# EAGLE design Schm1 (EAGLE 6.6.0)
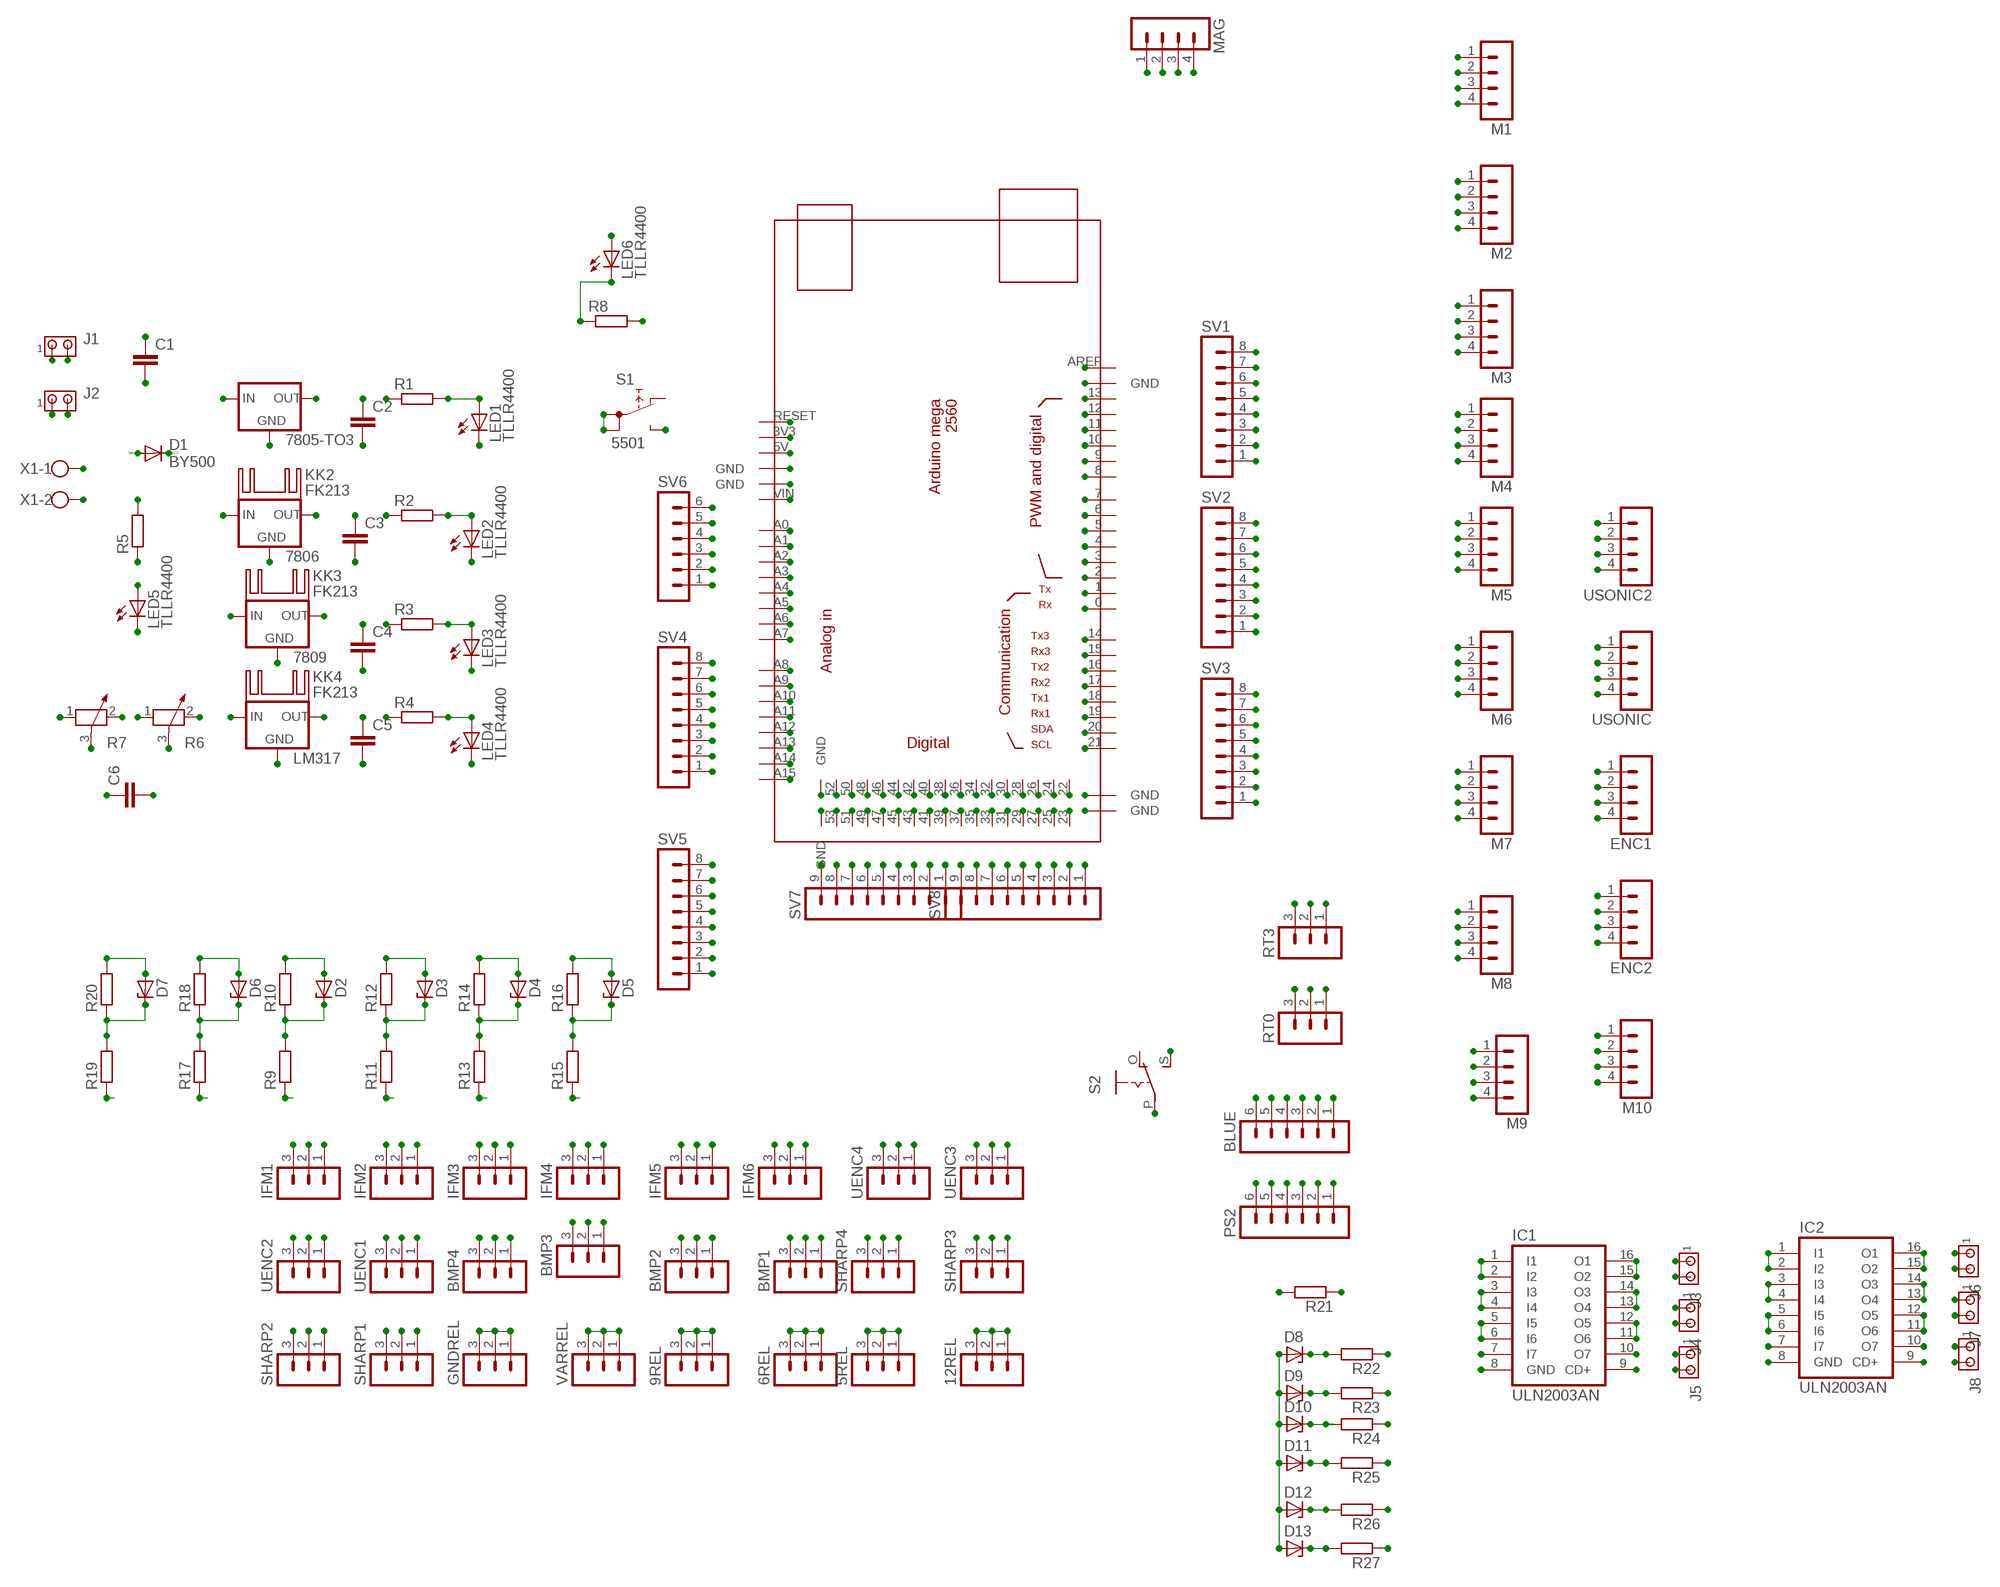
[diagram p0: schematic, sheet 1]

## Parts
5REL  MA03-1  [MA03-1]
6REL  MA03-1  [MA03-1]
9REL  MA03-1  [MA03-1]
12REL  MA03-1  [MA03-1]
7805-TO3  78XX-TO3  [TO3-78]
7806  78XXS  [78XXS]
7809  78XXS  [78XXS]
BLUE  MA06-1  [MA06-1]
BMP1  MA03-1  [MA03-1]
BMP2  MA03-1  [MA03-1]
BMP3  MA03-1  [MA03-1]
BMP4  MA03-1  [MA03-1]
C1  C-EU075-063X106  [C075-063X106]
C2  C-EU050-075X075  [C050-075X075]
C3  C-EU050-075X075  [C050-075X075]
C4  C-EU050-075X075  [C050-075X075]
C5  C-EU050-075X075  [C050-075X075]
C6  C-EU050-075X075  [C050-075X075]
D1  BY500  [DO201-15]
D2  ZENER-DIODEDO34-7  [DO34Z7]
D3  ZENER-DIODEDO34-7  [DO34Z7]
D4  ZENER-DIODEDO34-7  [DO34Z7]
D5  ZENER-DIODEDO34-7  [DO34Z7]
D6  ZENER-DIODEDO34-7  [DO34Z7]
D7  ZENER-DIODEDO34-7  [DO34Z7]
D8  ZENER-DIODEDO34-7  [DO34Z7]
D9  ZENER-DIODEDO34-7  [DO34Z7]
D10  ZENER-DIODEDO34-7  [DO34Z7]
D11  ZENER-DIODEDO34-7  [DO34Z7]
D12  ZENER-DIODEDO34-7  [DO34Z7]
D13  ZENER-DIODEDO34-7  [DO34Z7]
ENC1  MA04-1  [MA04-1]
ENC2  MA04-1  [MA04-1]
GNDREL  MA03-1  [MA03-1]
IC1  ULN2003AN  [DIL16]
IC2  ULN2003AN  [DIL16]
IFM1  MA03-1  [MA03-1]
IFM2  MA03-1  [MA03-1]
IFM3  MA03-1  [MA03-1]
IFM4  MA03-1  [MA03-1]
IFM5  MA03-1  [MA03-1]
IFM6  MA03-1  [MA03-1]
J1  MTA02-156  [1X2MTA]
J2  MTA02-156  [1X2MTA]
J3  MTA02-100  [10X02MTA]
J4  MTA02-100  [10X02MTA]
J5  MTA02-100  [10X02MTA]
J6  MTA02-100  [10X02MTA]
J7  MTA02-100  [10X02MTA]
J8  MTA02-100  [10X02MTA]
KK2  FK213  [FK213]
KK3  FK213  [FK213]
KK4  FK213  [FK213]
LED1  TLLR4400  [LED3MM]
LED2  TLLR4400  [LED3MM]
LED3  TLLR4400  [LED3MM]
LED4  TLLR4400  [LED3MM]
LED5  TLLR4400  [LED3MM]
LED6  TLLR4400  [LED3MM]
LM317  78XXS  [78XXS]
M1  MA04-1  [MA04-1]
M2  MA04-1  [MA04-1]
M3  MA04-1  [MA04-1]
M4  MA04-1  [MA04-1]
M5  MA04-1  [MA04-1]
M6  MA04-1  [MA04-1]
M7  MA04-1  [MA04-1]
M8  MA04-1  [MA04-1]
M9  MA04-1  [MA04-1]
M10  MA04-1  [MA04-1]
MAG  MA04-1  [MA04-1]
PS2  MA06-1  [MA06-1]
R1  R-EU_0207/10  [0207/10]
R2  R-EU_0207/10  [0207/10]
R3  R-EU_0207/10  [0207/10]
R4  R-EU_0207/10  [0207/10]
R5  R-EU_0207/10  [0207/10]
R6  POTENTIOMETER_PT-10  [PT-10]
R7  POTENTIOMETER_PT-10  [PT-10]
R8  R-EU_0207/10  [0207/10]
R9  R-EU_0207/10  [0207/10]
R10  R-EU_0207/10  [0207/10]
R11  R-EU_0207/10  [0207/10]
R12  R-EU_0207/10  [0207/10]
R13  R-EU_0207/10  [0207/10]
R14  R-EU_0207/10  [0207/10]
R15  R-EU_0207/10  [0207/10]
R16  R-EU_0207/10  [0207/10]
R17  R-EU_0207/10  [0207/10]
R18  R-EU_0207/10  [0207/10]
R19  R-EU_0207/10  [0207/10]
R20  R-EU_0207/10  [0207/10]
R21  R-EU_0207/10  [0207/10]
R22  R-EU_0207/10  [0207/10]
R23  R-EU_0207/10  [0207/10]
R24  R-EU_0207/10  [0207/10]
R25  R-EU_0207/10  [0207/10]
R26  R-EU_0207/10  [0207/10]
R27  R-EU_0207/10  [0207/10]
RT0  MA03-1  [MA03-1]
RT3  MA03-1  [MA03-1]
S1  5501  [5501]
S2  EG1218S  [EG1218]
SHARP1  MA03-1  [MA03-1]
SHARP2  MA03-1  [MA03-1]
SHARP3  MA03-1  [MA03-1]
SHARP4  MA03-1  [MA03-1]
SV1  MA08-1  [MA08-1]
SV2  MA08-1  [MA08-1]
SV3  MA08-1  [MA08-1]
SV4  MA08-1  [MA08-1]
SV5  MA08-1  [MA08-1]
SV6  MA06-1  [MA06-1]
SV7  MA09-1  [MA09-1]
SV8  MA09-1  [MA09-1]
U$1  MEGA_DEVICE  [MEGABOX]
UENC1  MA03-1  [MA03-1]
UENC2  MA03-1  [MA03-1]
UENC3  MA03-1  [MA03-1]
UENC4  MA03-1  [MA03-1]
USONIC  MA04-1  [MA04-1]
USONIC2  MA04-1  [MA04-1]
VARREL  MA03-1  [MA03-1]
X1  W237-102  [W237-102]

## Nets
0: RT0.2 SV2.1 U$1.0
1: RT0.3 SV2.2 U$1.1
2: ENC1.1 SV2.3 U$1.2 UENC1.3
3: ENC1.2 SV2.4 U$1.3 UENC2.3
3V3: MAG.2 SV6.5 U$1.3V3
4: M1.1 SV2.5 U$1.4
5: M6.1 SV2.6 U$1.5
5OUT: 5REL.1 5REL.2 5REL.3 7805-TO3.1(OUT) BLUE.3 BMP1.2 BMP2.2 BMP3.2 BMP4.2 C2.1 ENC1.3 ENC2.3 PS2.2 R1.1 R21.1 SHARP1.1 SHARP2.1 SHARP3.1 SHARP4.1 UENC1.2 UENC2.2 UENC3.2 UENC4.2 USONIC2.4 USONIC.4
6: M7.1 SV2.7 U$1.6
6OUT: 6REL.1 6REL.2 6REL.3 7806.OUT C3.1 R2.1
7: M8.1 SV2.8 U$1.7
8: M9.1 SV1.1 U$1.8
9: M10.1 SV1.2 U$1.9
10: M5.1 SV1.3 U$1.10
11: M4.1 SV1.4 U$1.11
12: M3.1 SV1.5 U$1.12
12IN: 7805-TO3.2(IN) 7806.IN 7809.IN C6.1 D1.C LM317.IN
12V: 12REL.1 12REL.2 12REL.3 C1.1 D1.A IC1.9(CD+) IC2.9(CD+) IFM1.2 IFM2.2 IFM3.2 IFM4.2 IFM5.2 IFM6.2 J1.1 J2.1 J3.1 J4.1 J5.1 J6.1 J7.1 J8.1 R5.2 X1.1
13: M2.1 SV1.6 U$1.13
14: RT3.3 SV3.8 U$1.14
15: RT3.2 SV3.7 U$1.15
16: BLUE.5 SV3.6 U$1.16
17: BLUE.4 SV3.5 U$1.17
18: ENC2.1 SV3.4 U$1.18 UENC3.3
19: ENC2.2 SV3.3 U$1.19 UENC4.3
20: MAG.3 SV3.2 U$1.20
21: MAG.4 SV3.1 U$1.21
22: M1.2 U$1.22
23: M1.3 SV8.2 U$1.23
24: M2.2 U$1.24
25: M6.2 SV8.3 U$1.25
26: M2.3 U$1.26
27: M6.3 SV8.4 U$1.27
28: M3.2 U$1.28
29: M7.2 SV8.5 U$1.29
30: M3.3 U$1.30
31: M7.3 SV8.6 U$1.31
32: M4.2 U$1.32
33: M8.2 SV8.7 U$1.33
34: M4.3 U$1.34
35: M8.3 SV8.8 U$1.35
36: M5.2 U$1.36
37: M9.2 SV8.9 U$1.37
38: M5.3 U$1.38
39: M9.3 SV7.1 U$1.39
40: BMP4.3 U$1.40
41: D11.C R25.2 SV7.2 U$1.41
42: BMP2.3 U$1.42
43: D12.C R26.2 SV7.3 U$1.43
44: BMP1.3 U$1.44
45: D13.C R27.2 SV7.4 U$1.45
46: BMP3.3 U$1.46
47: PS2.6 SV7.5 U$1.47
48: D10.C R24.2 U$1.48
49: PS2.5 SV7.6 U$1.49
50: D9.C R23.2 U$1.50
51: PS2.4 SV7.7 U$1.51
52: D8.C R22.2 U$1.52
53: PS2.3 R21.2 SV7.8 U$1.53
A0: M10.3 SV4.8 U$1.A0
A1: M10.2 SV4.7 U$1.A1
A2: SHARP1.3 SV4.6 U$1.A2
A3: SHARP2.3 SV4.5 U$1.A3
A4: SHARP3.3 SV4.4 U$1.A4
A5: SHARP4.3 SV4.3 U$1.A5
A6: SV4.2 U$1.A6 USONIC.3
A7: SV4.1 U$1.A7 USONIC.2
A8: SV5.8 U$1.A8 USONIC2.3
A9: SV5.7 U$1.A9 USONIC2.2
A10: D7.C R19.2 R20.1 SV5.6 U$1.A10
A11: D6.C R17.2 R18.1 SV5.5 U$1.A11
A12: D2.C R9.2 R10.1 SV5.4 U$1.A12
A13: D3.C R11.2 R12.1 SV5.3 U$1.A13
A14: D4.C R13.2 R14.1 SV5.2 U$1.A14
A15: D5.C R15.2 R16.1 SV5.1 U$1.A15
AREF: SV1.8 U$1.AREF
B3V3: BLUE.2 S2.P
DIN: LED5.A R5.1
GND: 7805-TO3.3(GND) 7806.GND 7809.GND BLUE.1 BMP1.1 BMP2.1 BMP3.1 BMP4.1 C1.2 C2.2 C3.2 C4.2 C5.2 C6.2 D2.A D3.A D4.A D5.A D6.A D7.A D8.A D9.A D10.A D11.A D12.A D13.A ENC1.4 ENC2.4 GNDREL.1 GNDREL.2 GNDREL.3 IC1.8(GND) IC2.8(GND) IFM1.1 IFM2.1 IFM3.1 IFM4.1 IFM5.1 IFM6.1 J1.2 J2.2 LED1.K(C) LED2.K(C) LED3.K(C) LED4.K(C) LED5.K(C) M1.4 M2.4 M3.4 M4.4 M5.4 M6.4 M7.4 M8.4 M9.4 M10.4 MAG.1 PS2.1 R7.3 R8.2 R10.2 R12.2 R14.2 R16.2 R18.2 R20.2 RT0.1 RT3.1 S1.NO SHARP1.2 SHARP2.2 SHARP3.2 SHARP4.2 SV1.7 SV6.2 SV6.3 SV7.9 U$1.GND@1(GND) U$1.GND@2(GND) U$1.GND@3(GND) U$1.GND@6(GND) U$1.GND@7(GND) UENC1.1 UENC2.1 UENC3.1 UENC4.1 USONIC2.1 USONIC.1 X1.2
JOK1: LM317.GND R6.3 R7.1
KEY: BLUE.6 S2.S
N$3: R7.2
N$4: LED6.K(C) R8.1
N$7: R6.2
N$10: IC1.7(I7)
N$13: LED4.A R4.2
N$16: LED3.A R3.2
N$17: LED2.A R2.2
N$20: LED1.A R1.2
N$22: IC1.10(O7)
N$25: IC2.7(I7)
N$38: IC2.10(O7)
PN1: IC1.15(O2) IC1.16(O1) J3.2
PN2: IC1.13(O4) IC1.14(O3) J4.2
PN3: IC1.11(O6) IC1.12(O5) J5.2
PN4: IC2.15(O2) IC2.16(O1) J6.2
PN5: IC2.13(O4) IC2.14(O3) J7.2
PN6: IC2.11(O6) IC2.12(O5) J8.2
RESET: S1.1A S1.1B SV6.6 U$1.RESET
S1: IFM1.3 R19.1
S2: IFM2.3 R17.1
S3: IFM3.3 R9.1
S4: IFM4.3 R11.1
S5: IFM5.3 R13.1
S6: IFM6.3 R15.1
U1: IC1.5(I5) IC1.6(I6) R22.1
U2: IC1.3(I3) IC1.4(I4) R23.1
U3: IC1.1(I1) IC1.2(I2) R24.1
U4: IC2.5(I5) IC2.6(I6) R25.1
U5: IC2.3(I3) IC2.4(I4) R26.1
U6: IC2.1(I1) IC2.2(I2) R27.1
VAROUT: C5.1 LM317.OUT R4.1 R6.1 VARREL.1 VARREL.2 VARREL.3
VCC: LED6.A SV6.4 SV8.1 U$1.5V U$1.GND@4(GND) U$1.GND@5(GND)
VIN: 9REL.1 9REL.2 9REL.3 7809.OUT C4.1 R3.1 SV6.1 U$1.VIN
Unconnected: S1.NC S2.O

## Library data of the parts
5REL 6REL 9REL 12REL BMP1-BMP4 GNDREL IFM1-IFM6 RT0 RT3 SHARP1-SHARP4 UENC1-UENC4 VARREL = con-lstb:MA03-1: PIN HEADER; OC_FARNELL: unknown; OC_NEWARK: unknown
7805-TO3 = v-reg:78XX-TO3: VOLTAGE REGULATOR
7806 7809 LM317 = v-reg:78XXS: VOLTAGE REGULATOR
BLUE PS2 SV6 = con-lstb:MA06-1: PIN HEADER; OC_FARNELL: unknown; OC_NEWARK: unknown
C1-C6 = rcl:C-EU: CAPACITOR, European symbol
D1 = diode:BY500: DIODE fast recovery diode, 5 A, 800 V
D2-D13 = diode:ZENER-DIODE: Z-Diode
ENC1 ENC2 M1-M10 MAG USONIC USONIC2 = con-lstb:MA04-1: PIN HEADER; OC_FARNELL: unknown; OC_NEWARK: unknown
IC1 IC2 = uln-udn:ULN2003A: DRIVER ARRAY
J1 J2 = con-amp:MTA02-156: AMP connector
J3-J8 = con-amp:MTA02-100: AMP connector
KK2-KK4 = heatsink:FK213: HEATSINK manufacturer Fischer/distributor Buerklin
LED1-LED6 = led:TLLR4400: Low Current (2mA) LED 3 mm Tinted Diffused Package color RED Source: Data sheet <http://www.farnell.com/datasheets/391100.pdf>; MF: VISHAY SEMICONDUCTOR; OC_FARNELL: 1612437
R1-R5 R8-R27 = rcl:R-EU_: RESISTOR, European symbol
R6 R7 = rcl:POTENTIOMETER_: Potentiometer
S1 = switch:55?: PUSHBUTTON SERIES 5500 SWITCHES Source: www.e-switch.com .. 5500.pdf
S2 = adafruit:EG1218: SLIDING SWITCH 0.1" spacing through hole, vertical SPDT slide switch http://www.ladyada.net/library/pcb/eaglelibrary.html
SV1-SV5 = con-lstb:MA08-1: PIN HEADER; OC_FARNELL: unknown; OC_NEWARK: unknown
SV7 SV8 = con-lstb:MA09-1: PIN HEADER; OC_FARNELL: unknown; OC_NEWARK: unknown
U$1 = ArduinoMegaSymbol:MEGA_DEVICE: mega card as device
X1 = con-wago-500:W237-102: WAGO SCREW CLAMP; MPN: 237-102; OC_FARNELL: unknown; OC_NEWARK: 70K9898

## Net classes
0 default: width 1.016 mm, drill 0.61 mm, clearance 0.61 mm

## Board
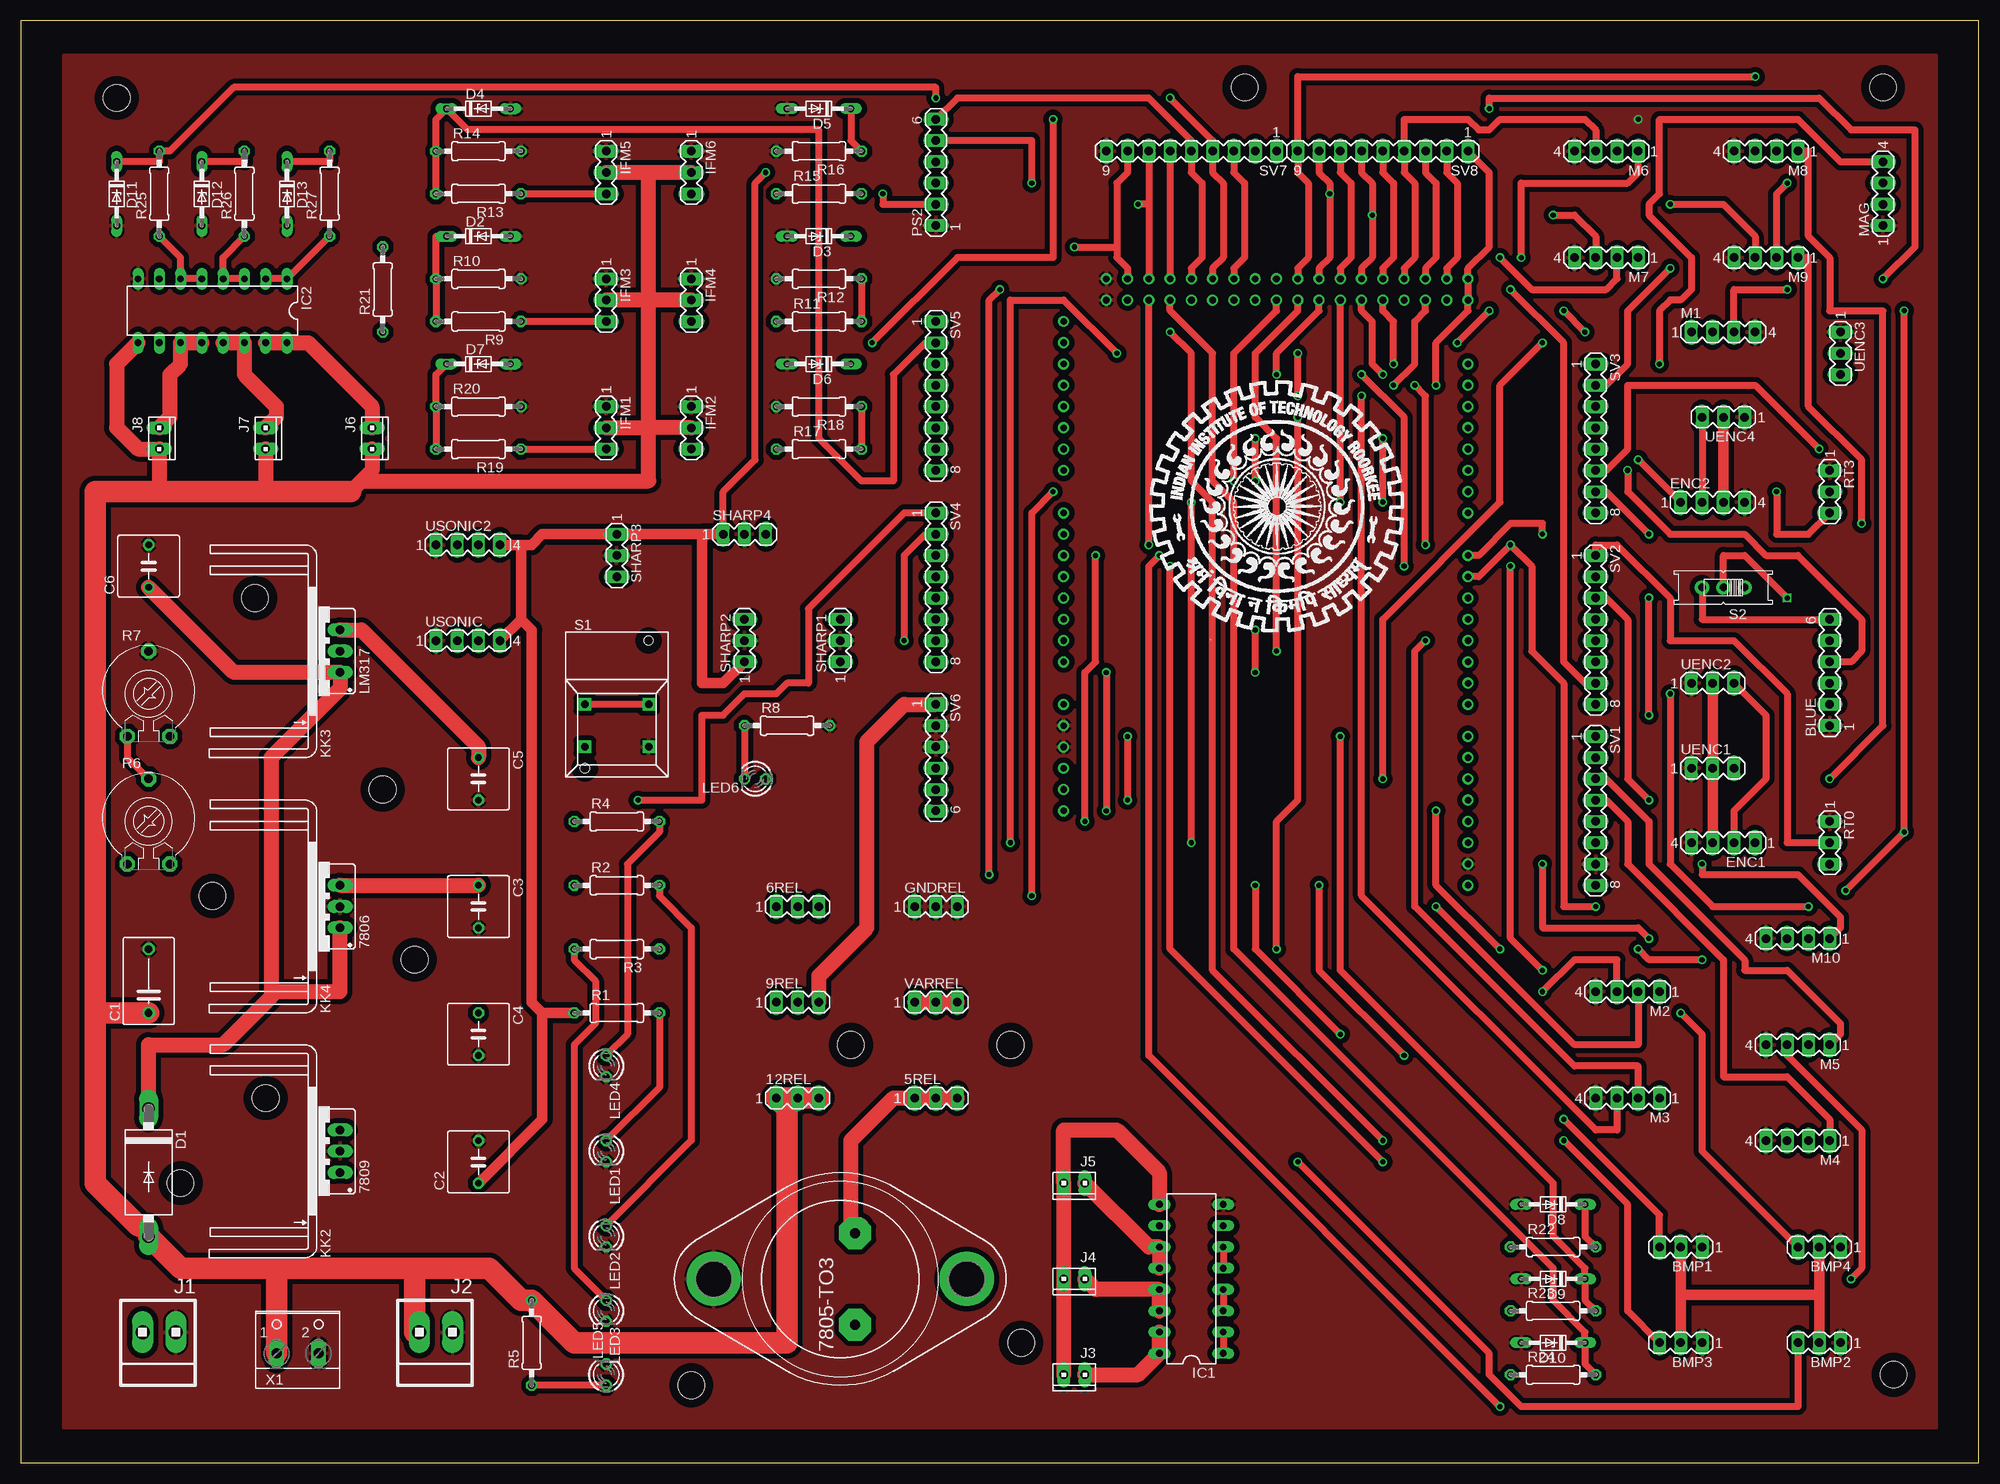
[diagram p1: board, top side]
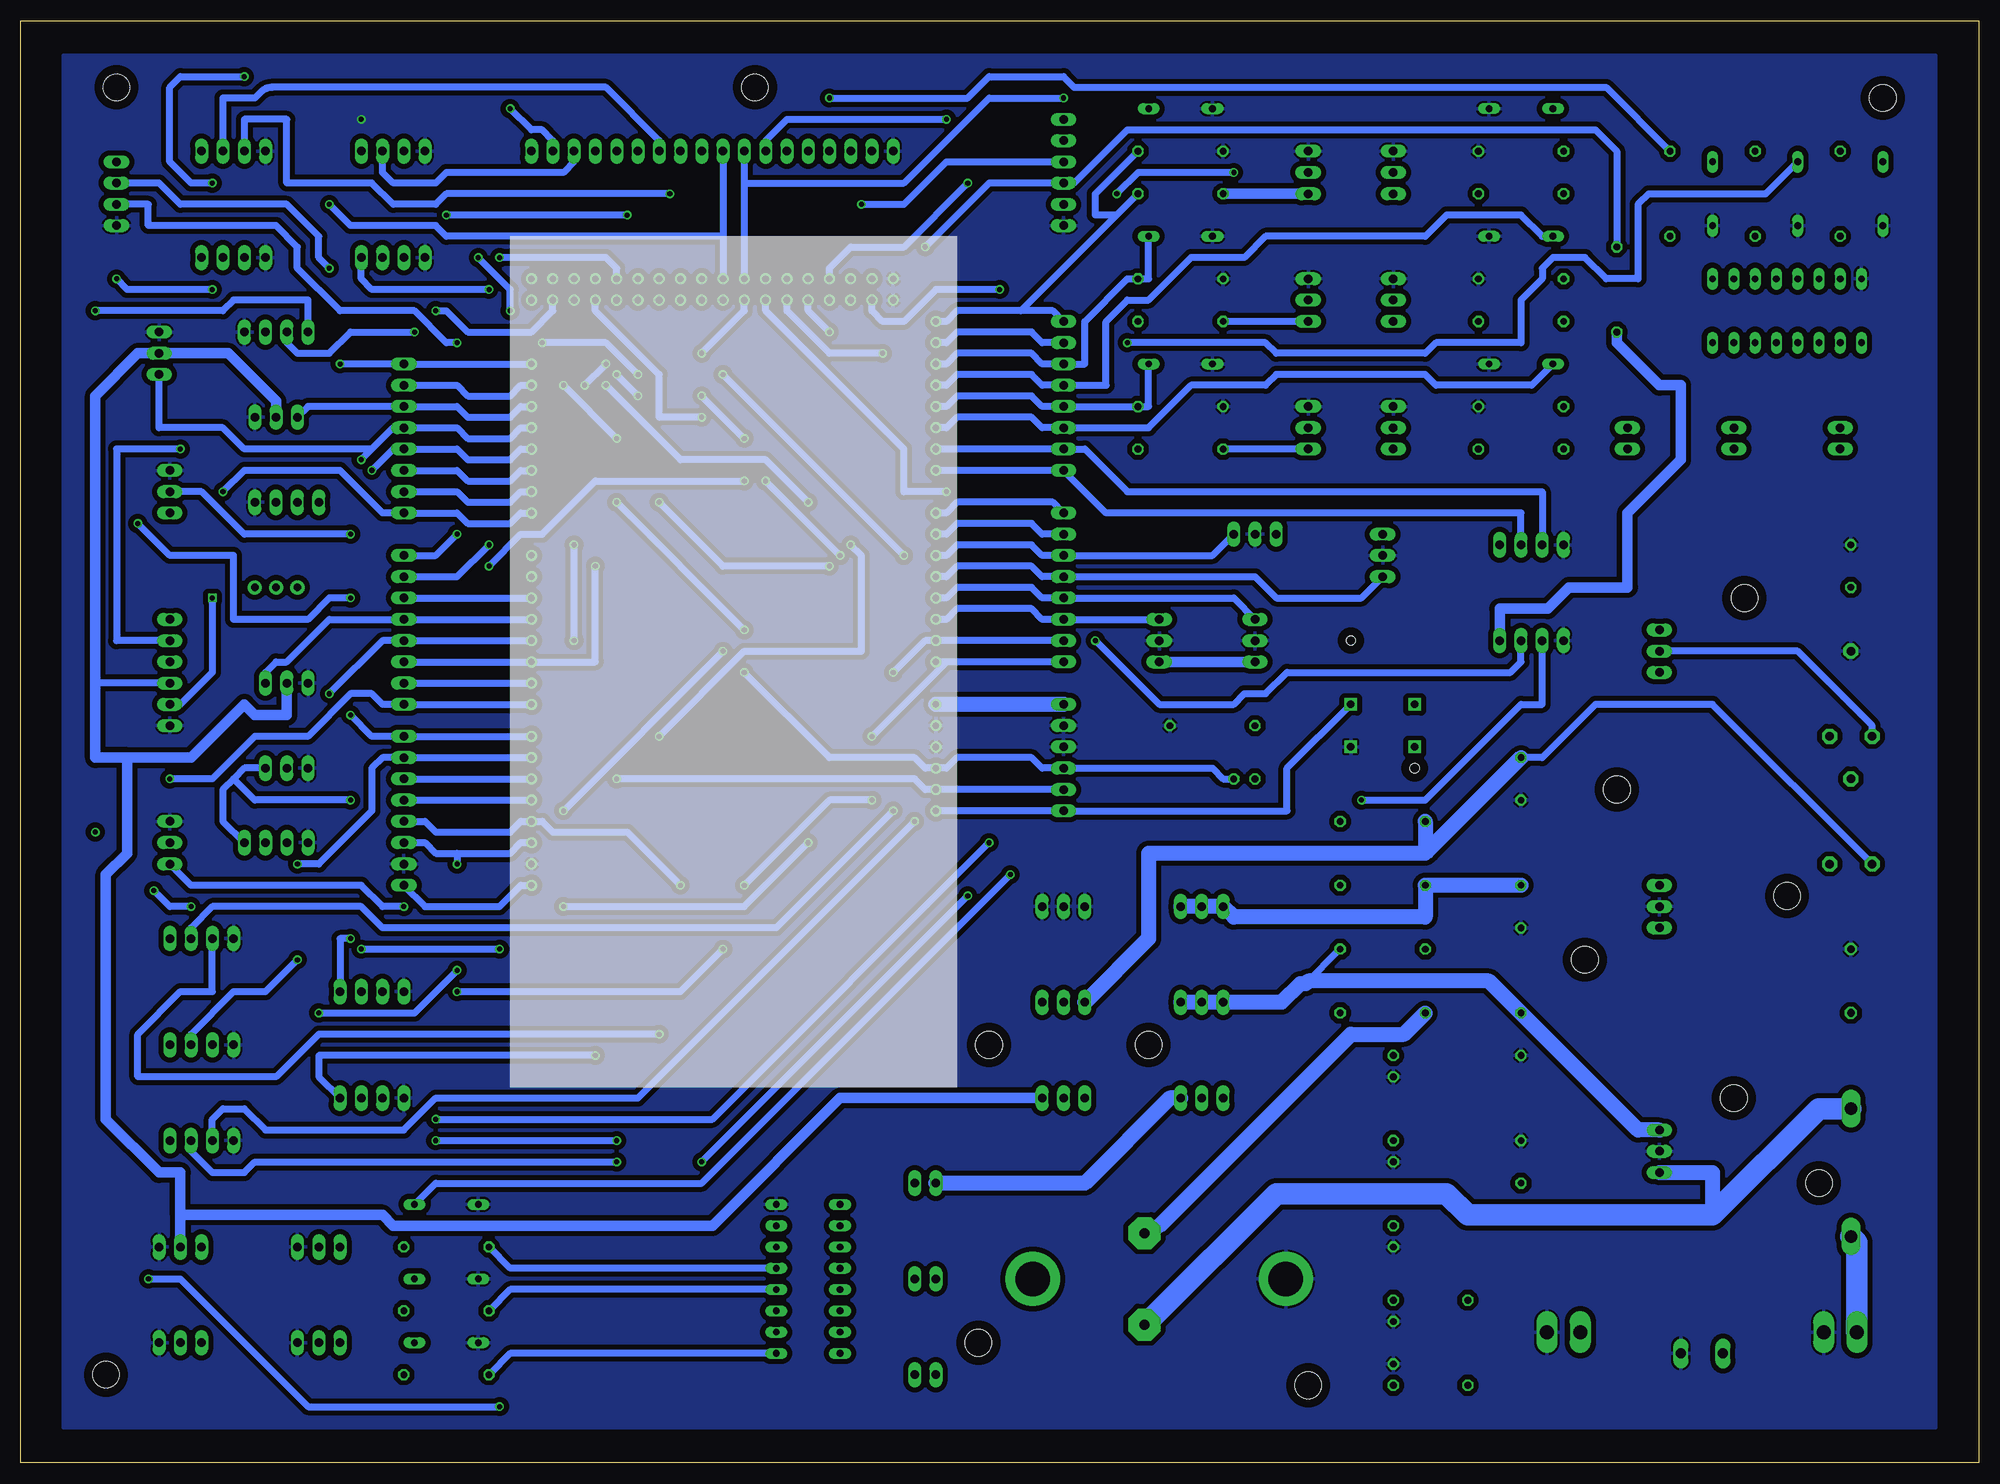
[diagram p2: board, bottom side, seen from below]

Size 233.66 x 172.14 mm. Coordinates in mm from the lower left corner, seen from the top.
Outline: 0,0 233.66,0 233.66,172.14 0,172.14 0,0
Copper layers (1*16): Top 0.035mm / dielectric 1.5mm / Bottom 0.035mm
Design rules "default": minimum track width 10mil, minimum drill 24mil, track to track 8mil, track to pad 8mil, pad to pad 8mil, via to via 8mil, smd to smd 8mil, copper to edge 40mil, drill to drill 8mil, minimum pad ring 10mil, minimum via ring 8mil, stop-mask expansion 4mil, vias tented up to drill 0mil, thermal gap 10mil
Holes 3.2 mm at 11.43,162.94 43.18,80.39 19.05,33.4 223.52,10.54 119.38,14.35 222.25,164.21 146.05,164.21 99.06,49.91 22.86,67.69 46.99,60.07 29.21,43.56 80.01,9.27 118.11,49.91 27.94,103.25

### Footprints (pad centres in the part's own frame; a part is rotated, then mirrored left to right if it is on the bottom)
MA03-1 = drill 1.016 long: 1 -2.54,0; 2 0,0; 3 2.54,0
TO3-78 = drill 1.194 pad 3.81 octagon: 1 -1.778,-5.461; 2 -1.778,5.461 | drill 4.115 pad 6.477: 3 15.113,0; 3@ -15.113,0
78XXS = drill 1.016 long: GND 0,-2.54; IN -2.54,-2.54; OUT 2.54,-2.54
MA06-1 = drill 1.016 long: 1 -6.35,0; 2 -3.81,0; 3 -1.27,0; 4 1.27,0; 5 3.81,0; 6 6.35,0
C075-063X106 = drill 0.914 octagon: 1 -3.81,0; 2 3.81,0
C050-075X075 = drill 0.813 octagon: 1 -2.54,0; 2 2.54,0
DO201-15 = drill 1.499 long: A 7.62,0; C -7.62,0
DO34Z7 = drill 0.813 long: A 3.81,0; C -3.81,0
MA04-1 = drill 1.016 long: 1 -3.81,0; 2 -1.27,0; 3 1.27,0; 4 3.81,0
DIL16 = drill 0.813 long: 1 -8.89,-3.81; 2 -6.35,-3.81; 3 -3.81,-3.81; 4 -1.27,-3.81; 5 1.27,-3.81; 6 3.81,-3.81; 7 6.35,-3.81; 8 8.89,-3.81; 9 8.89,3.81; 10 6.35,3.81; 11 3.81,3.81; 12 1.27,3.81; 13 -1.27,3.81; 14 -3.81,3.81; 15 -6.35,3.81; 16 -8.89,3.81
1X2MTA = drill 1.676 long: 1 1.981,0; 2 -1.981,0
10X02MTA = drill 1.016 long: 1 1.27,0; 2 -1.27,0
LED3MM = drill 0.813 octagon: A -1.27,0; K 1.27,0
0207/10 = drill 0.813 octagon: 1 -5.08,0; 2 5.08,0
PT-10 = drill 1.016 pad 1.778 octagon: 1 -2.54,-5.08; 2 2.54,-5.08; 3 0,5.08
5501 = drill 0.9 pad 1.5 square: 1A 0,3.81; 1B 0,-3.81; NC 5.08,-3.81; NO 5.08,3.81 | hole 1.1: -7.62,3.81; 7.62,-3.81
EG1218 = drill 0.9 pad 1.676: O -2.54,0; P 0,0; S 2.54,0
MA08-1 = drill 1.016 long: 1 -8.89,0; 2 -6.35,0; 3 -3.81,0; 4 -1.27,0; 5 1.27,0; 6 3.81,0; 7 6.35,0; 8 8.89,0
MA09-1 = drill 1.016 long: 1 -10.16,0; 2 -7.62,0; 3 -5.08,0; 4 -2.54,0; 5 0,0; 6 2.54,0; 7 5.08,0; 8 7.62,0; 9 10.16,0
MEGABOX = drill 0.8: 0 12.7,24.13; 1 10.16,24.13; 2 7.62,24.13; 3 5.08,24.13; 3V3 -15.24,-24.13; 4 2.54,24.13; 5 0,24.13; 5V -12.7,-24.13; 6 -2.54,24.13; 7 -5.08,24.13; 8 -8.89,24.13; 9 -11.43,24.13; 10 -13.97,24.13; 11 -16.51,24.13; 12 -19.05,24.13; 13 -21.59,24.13; 14 17.78,24.13; 15 20.32,24.13; 16 22.86,24.13; 17 25.4,24.13; 18 27.94,24.13; 19 30.48,24.13; 20 33.02,24.13; 21 35.56,24.13; 22 43.18,21.59; 23 45.72,21.59; 24 43.18,19.05; 25 45.72,19.05; 26 43.18,16.51; 27 45.72,16.51; 28 43.18,13.97; 29 45.72,13.97; 30 43.18,11.43; 31 45.72,11.43; 32 43.18,8.89; 33 45.72,8.89; 34 43.18,6.35; 35 45.72,6.35; 36 43.18,3.81; 37 45.72,3.81; 38 43.18,1.27; 39 45.72,1.27; 40 43.18,-1.27; 41 45.72,-1.27; 42 43.18,-3.81; 43 45.72,-3.81; 44 43.18,-6.35; 45 45.72,-6.35; 46 43.18,-8.89; 47 45.72,-8.89; 48 43.18,-11.43; 49 45.72,-11.43; 50 43.18,-13.97; 51 45.72,-13.97; 52 43.18,-16.51; 53 45.72,-16.51; A0 0,-24.13; A1 2.54,-24.13; A2 5.08,-24.13; A3 7.62,-24.13; A4 10.16,-24.13; A5 12.7,-24.13; A6 15.24,-24.13; A7 17.78,-24.13; A8 22.86,-24.13; A9 25.4,-24.13; A10 27.94,-24.13; A11 30.48,-24.13; A12 33.02,-24.13; A13 35.56,-24.13; A14 38.1,-24.13; A15 40.64,-24.13; AREF -26.67,24.13; GND@1 -24.13,24.13; GND@2 -10.16,-24.13; GND@3 -7.62,-24.13; GND@4 43.18,24.13; GND@5 45.72,24.13; GND@6 43.18,-19.05; GND@7 45.72,-19.05; RESET -17.78,-24.13; VIN -5.08,-24.13
W237-102 = drill 1.194 long: 1 -2.5,-1.27; 2 2.5,-1.27

### Placement (x,y rotation side)
5REL  109.22,43.56 0 top
6REL  92.71,66.42 0 top
9REL  92.71,54.99 0 top
12REL  92.71,43.56 0 top
7805-TO3  97.79,21.97 180 top
7806  35.56,66.42 90 top
7809  35.56,37.21 90 top
BLUE  215.9,94.36 90 top
BMP1  198.12,25.78 180 top
BMP2  214.63,14.35 180 top
BMP3  198.12,14.35 180 top
BMP4  214.63,25.78 180 top
C1  15.24,57.53 90 top
C2  54.61,35.94 90 top
C3  54.61,66.42 270 top
C4  54.61,51.18 270 top
C5  54.61,81.66 270 top
C6  15.24,107.06 90 top
D1  15.24,34.67 270 top
D2  54.61,146.43 0 top
D3  95.25,146.43 180 top
D4  54.61,161.67 0 top
D5  95.25,161.67 180 top
D6  95.25,131.19 180 top
D7  54.61,131.19 0 top
D8  182.88,30.86 180 top
D9  182.88,21.97 180 top
D10  182.88,14.35 180 top
D11  11.43,151.51 270 top
D12  21.59,151.51 270 top
D13  31.75,151.51 270 top
ENC1  203.2,74.04 180 top
ENC2  201.93,114.68 0 top
GNDREL  109.22,66.42 0 top
IC1  139.7,21.97 90 top
IC2  22.86,137.54 180 top
IFM1  69.85,123.57 270 top
IFM2  80.01,123.57 270 top
IFM3  69.85,138.81 270 top
IFM4  80.01,138.81 270 top
IFM5  69.85,154.05 270 top
IFM6  80.01,154.05 270 top
J1  16.51,15.62 180 top
J2  49.53,15.62 180 top
J3  125.73,10.54 180 top
J4  125.73,21.97 180 top
J5  125.73,33.4 180 top
J6  41.91,122.3 270 top
J7  29.21,122.3 270 top
J8  16.51,122.3 270 top
KK2  34.29,37.21 90 top
KK3  34.29,96.9 90 top
KK4  34.29,66.42 90 top
LED1  69.85,37.21 270 top
LED2  69.85,27.05 270 top
LED3  69.85,18.16 270 top
LED4  69.85,47.37 270 top
LED5  69.85,10.54 90 top
LED6  87.63,81.66 180 top
LM317  35.56,96.9 90 top
M1  203.2,135 0 top
M2  191.77,56.26 180 top
M3  191.77,43.56 180 top
M4  212.09,38.48 180 top
M5  212.09,49.91 180 top
M6  189.23,156.59 180 top
M7  189.23,143.89 180 top
M8  208.28,156.59 180 top
M9  208.28,143.89 180 top
M10  212.09,62.61 180 top
MAG  222.25,151.51 90 top
PS2  109.22,154.05 90 top
R1  71.12,53.72 0 top
R2  71.12,68.96 0 top
R3  71.12,61.34 180 top
R4  71.12,76.58 0 top
R5  60.96,14.35 90 top
R6  15.24,76.58 0 top
R7  15.24,91.82 0 top
R8  91.44,88.01 0 top
R9  54.61,136.27 180 top
R10  54.61,141.35 0 top
R11  95.25,136.27 0 top
R12  95.25,141.35 180 top
R13  54.61,151.51 180 top
R14  54.61,156.59 0 top
R15  95.25,151.51 0 top
R16  95.25,156.59 180 top
R17  95.25,121.03 0 top
R18  95.25,126.11 180 top
R19  54.61,121.03 180 top
R20  54.61,126.11 0 top
R21  43.18,140.08 90 top
R22  182.88,25.78 0 top
R23  182.88,18.16 0 top
R24  182.88,10.54 0 top
R25  16.51,151.51 90 top
R26  26.67,151.51 90 top
R27  36.83,151.51 90 top
RT0  215.9,74.04 270 top
RT3  215.9,115.95 270 top
S1  71.12,90.55 270 top
S2  203.2,104.52 180 top
SHARP1  97.79,98.17 90 top
SHARP2  86.36,98.17 90 top
SHARP3  71.12,108.33 270 top
SHARP4  86.36,110.87 0 top
SV1  187.96,77.85 270 top
SV2  187.96,99.44 270 top
SV3  187.96,122.3 270 top
SV4  109.22,104.52 270 top
SV5  109.22,127.38 270 top
SV6  109.22,84.2 270 top
SV7  139.7,156.59 180 top
SV8  162.56,156.59 180 top
U$1  148.59,95.63 90 bottom
U$2  [IITR_2]  134.62,98.17 0 top
UENC1  201.93,82.93 0 top
UENC2  201.93,93.09 0 top
UENC3  217.17,132.46 270 top
UENC4  203.2,124.84 180 top
USONIC  53.34,98.17 0 top
USONIC2  53.34,109.6 0 top
VARREL  109.22,54.99 0 top
X1  33.02,14.35 0 top

### Tracks (layer width: path | path; a pad name or v marks a point on that pad's centre or on a via)
0  (via drill 0.61)
  Top 0.813: U$1.0 173.99,108.33 177.8,112.14 181.61,112.14 v181.61,110.87 | RT0.2 210.82,74.04 210.82,91.82 204.47,98.17 196.85,98.17 196.85,103.25 190.5,109.6 187.96,109.6 SV2.1
  Bottom 0.813: v181.61,110.87 184.15,108.33 SV2.1
1  (via drill 0.61)
  Top 0.813: U$1.1 173.99,105.79 v177.8,109.6 180.34,107.06 180.34,96.9 184.15,93.09 184.15,66.42 v187.96,66.42
  Bottom 0.813: v177.8,109.6 181.61,105.79 SV2.2 | RT0.3 213.36,68.96 193.04,68.96 190.5,66.42 v187.96,66.42
2  (via drill 0.61)
  Top 0.813: v194.31,79.12 191.77,81.66 191.77,100.71 189.23,103.25 SV2.3
  Bottom 0.813: ENC1.1 209.55,76.58 209.55,80.39 208.28,81.66 | 208.28,81.66 207.01,82.93 UENC1.3 | SV2.3 U$1.2 | 208.28,81.66 205.74,79.12 v194.31,79.12
3
  Top 0.813: ENC1.2 204.47,77.85 208.28,81.66 208.28,89.28 UENC2.3
  Bottom 0.813: U$1.3 SV2.4 196.85,100.71 201.93,95.63 203.2,95.63 204.47,94.36 UENC2.3
3V3  (via drill 0.61)
  Top 0.813: v181.61,133.73 176.53,128.65 176.53,114.68 162.56,100.71 v162.56,81.66
  Bottom 0.813: SV6.5 U$1.3V3 125.73,80.39 127,81.66 v162.56,81.66 | v181.61,133.73 182.88,133.73 186.69,137.54 195.58,137.54 200.66,142.62 200.66,145.16 203.2,147.7 218.44,147.7 218.44,150.24 MAG.2
4  (via drill 0.6, 0.61)
  Top 0.813: v224.79,137.54 v224.79,75.31 v217.81,68.33 | v213.36,66.42 201.93,66.42 196.85,71.5 v196.85,91.82
  Bottom 0.813: U$1.4 SV2.5 190.5,98.17 v196.85,91.82 | v213.36,66.42 215.9,66.42 v217.81,68.33 | M1.1 199.39,138.81 208.28,138.81 209.55,137.54 v224.79,137.54
5  (via drill 0.61)
  Top 0.813: v179.07,143.89 179.07,152.78 191.77,152.78 193.04,154.05 M6.1 | v171.45,133.73 v175.26,137.54 | v160.02,129.92 165.1,124.84 v165.1,107.06
  Bottom 0.813: SV2.6 U$1.5 165.1,95.63 v165.1,107.06 | v179.07,143.89 175.26,140.08 v175.26,137.54 | v171.45,133.73 163.83,133.73 v160.02,129.92
5OUT  (via drill 0.61)
  Top 0.813: 100.33,28.32 7805-TO3.1 | PS2.2 102.87,150.24 v102.87,151.51 | v88.9,154.05 87.63,152.78 87.63,119.76 83.82,115.95 SHARP4.1
  Top 1.27: R1.1 62.23,53.72 | 62.23,53.72 60.96,54.99 60.96,99.44 59.69,100.71 | 59.69,100.71 59.69,109.6 | 59.69,109.6 USONIC2.4 | 59.69,109.6 60.96,109.6 62.23,110.87 SHARP3.1 81.28,110.87 | SHARP4.1 81.28,110.87 | 81.28,110.87 81.28,93.09 83.82,93.09 SHARP2.1 | 198.12,20.07 BMP3.2 | BMP4.2 214.63,20.07 | 214.63,20.07 BMP2.2 | BMP1.2 198.12,20.07 | 198.12,20.07 214.63,20.07 | UENC2.2 UENC1.2 ENC1.3 | UENC4.2 ENC2.3 | 59.69,100.71 USONIC.4 | 62.23,53.72 62.23,41.02 C2.1
  Top 1.778: 100.33,28.32 99.06,28.32 99.06,38.48 104.14,43.56 5REL.1 5REL.2 5REL.3
  Bottom 0.813: 97.79,28.32 99.06,28.32 7805-TO3.1 | v102.87,151.51 100.33,154.05 v88.9,154.05 | BLUE.3 224.79,93.09
  Bottom 1.27: SHARP2.1 SHARP1.1 | 5REL.3 135.89,43.56 151.13,28.32 189.23,28.32 190.5,29.59 214.63,29.59 | 214.63,29.59 BMP4.2 | 214.63,29.59 214.63,34.67 217.17,34.67 223.52,41.02 223.52,70.23 220.98,72.77 220.98,84.2 | 220.98,84.2 213.36,84.2 207.01,90.55 205.74,89.28 201.93,89.28 UENC2.2 | 220.98,84.2 224.79,84.2 224.79,93.09 224.79,127.38 219.71,132.46 UENC3.2 208.91,132.46 203.2,126.75 UENC4.2 | USONIC.4 57.15,101.98 51.44,101.98 48.9,104.52 41.91,104.52 41.91,113.41 35.56,119.76 35.56,128.65 38.1,128.65 43.18,133.73 R21.1
  Bottom 1.778: 97.79,28.32 74.93,51.18 68.58,51.18 R1.1
6  (via drill 0.61)
  Top 0.813: v177.8,140.08 184.15,133.73 184.15,95.63 186.69,93.09 SV2.7
  Bottom 0.813: SV2.7 U$1.6 | v177.8,140.08 191.77,140.08 193.04,141.35 M7.1
6OUT
  Top 1.778: 7806.OUT C3.1
  Bottom 1.778: 6REL.3 6REL.2 6REL.1 88.9,65.15 66.04,65.15 R2.1 C3.1
7  (via drill 0.61)
  Top 0.813: v215.9,81.66 222.25,88.01 222.25,137.54 215.9,137.54 215.9,143.89 213.36,146.43 213.36,156.59 M8.1
  Bottom 0.813: U$1.7 SV2.8 190.5,90.55 191.77,91.82 194.31,91.82 199.39,86.74 205.74,86.74 210.82,81.66 v215.9,81.66
8  (via drill 0.61)
  Top 0.813: M9.1 213.36,143.89 213.36,126.11 219.71,119.76 v219.71,112.14 | v194.31,89.28 v194.31,103.25
  Bottom 0.813: U$1.8 SV1.1 191.77,86.74 v194.31,89.28 | v194.31,103.25 196.85,103.25 199.39,100.71 208.28,100.71 208.28,108.33 215.9,108.33 v219.71,112.14
9  (via drill 0.61)
  Top 0.813: M10.1 217.17,63.88 217.17,65.15 212.09,70.23 200.66,70.23 v200.66,71.5
  Bottom 0.813: U$1.9 SV1.2 190.5,84.2 191.77,82.93 191.77,77.85 198.12,71.5 v200.66,71.5
10
  Top 0.813: M5.1 217.17,51.18 217.17,52.45 210.82,58.8 205.74,58.8 205.74,60.07 194.31,71.5 194.31,76.58 189.23,81.66 SV1.3
  Bottom 0.813: SV1.3 U$1.10
11
  Top 0.813: M4.1 215.9,41.02 210.82,46.1 203.2,46.1 203.2,60.07 191.77,71.5 191.77,76.58 189.23,79.12 SV1.4
  Bottom 0.813: SV1.4 U$1.11
12  (via drill 0.61)
  Top 0.813: v165.1,48.64 154.94,58.8 v154.94,68.96
  Bottom 0.813: SV1.5 185.42,76.58 184.15,75.31 175.26,75.31 173.99,76.58 U$1.12 171.45,76.58 170.18,75.31 161.29,75.31 v154.94,68.96 | M3.1 198.12,46.1 198.12,48.64 v165.1,48.64
12IN
  Top 1.778: D1.C 15.24,49.91 24.13,49.91 29.84,55.63 | 29.84,55.63 30.48,56.26 38.1,56.26 7806.IN | 29.84,55.63 29.84,84.2 38.1,92.46 LM317.IN 25.4,94.36 C6.1
  Bottom 0.813: 99.06,16.89 7805-TO3.2
  Bottom 1.778: 7809.IN 31.75,34.67 31.75,29.59
  Bottom 2.54: 99.06,16.89 83.82,32.13 63.5,32.13 60.96,29.59 31.75,29.59 19.05,42.29 D1.C
12V
  Top 0.813: 13.97,28.32 15.24,28.32 D1.A
  Top 1.778: IC2.9 11.43,131.19 11.43,123.57 13.97,121.03 J8.1 16.51,115.95 | J3.1 J4.1 J5.1 124.46,39.75 130.81,39.75 135.89,34.67 IC1.9 | IFM1.2 74.93,123.57 | 40.64,117.22 74.93,117.22 74.93,123.57 | IFM2.2 74.93,123.57 | 74.93,123.57 74.93,138.81 | 74.93,138.81 IFM3.2 | IFM4.2 74.93,138.81 | 74.93,138.81 74.93,154.05 | 74.93,154.05 IFM5.2 | IFM6.2 74.93,154.05 | J7.1 29.21,115.95 | J6.1 41.91,118.49 40.64,117.22 | 40.64,117.22 39.37,115.95
  Top 2.54: 13.97,28.32 8.89,33.4 8.89,53.72 | 8.89,53.72 8.89,115.95 16.51,115.95 29.21,115.95 39.37,115.95 | X1.1 30.52,23.2 30.48,23.24 | 30.48,23.24 19.05,23.24 D1.A | J2.1 46.99,15.62 46.99,23.24 | 46.99,23.24 55.88,23.24 59.69,19.43 R5.2 66.04,14.35 91.44,14.35 91.44,42.29 12REL.1 12REL.2 12REL.3 | C1.1 8.89,53.72 | 30.48,23.24 46.99,23.24
  Bottom 0.813: 48.26,15.62 J2.1
  Bottom 1.778: 12REL.3 96.52,43.56 106.68,33.4 J5.1
  Bottom 2.54: J1.1 14.53,26.34 D1.A
13  (via drill 0.61)
  Top 0.813: v194.31,62.61 193.04,63.88 181.61,63.88 v181.61,71.5
  Bottom 0.813: U$1.13 173.99,74.04 175.26,72.77 181.61,72.77 | 181.61,72.77 184.15,72.77 185.42,74.04 SV1.6 | M2.1 195.58,62.61 v194.31,62.61 | 181.61,72.77 v181.61,71.5
14  (via drill 0.61)
  Top 0.813: RT3.3 213.36,110.87 209.55,110.87 v209.55,115.95
  Bottom 0.813: U$1.14 173.99,113.41 175.26,112.14 180.34,112.14 181.61,113.41 SV3.8 190.5,113.41 195.58,118.49 207.01,118.49 v209.55,115.95
15  (via drill 0.61)
  Top 0.813: v194.31,110.87 189.23,115.95 SV3.7
  Bottom 0.813: U$1.15 173.99,115.95 175.26,114.68 180.34,114.68 181.61,115.95 SV3.7 | RT3.2 212.09,115.95 207.01,110.87 v194.31,110.87
16  (via drill 0.61)
  Top 0.813: v214.63,121.03 207.01,128.65 191.77,128.65 191.77,121.03 189.23,118.49 SV3.6
  Bottom 0.813: U$1.16 173.99,118.49 175.26,117.22 180.34,117.22 181.61,118.49 SV3.6 | v214.63,121.03 222.25,121.03 222.25,98.17 BLUE.5
17  (via drill 0.61)
  Top 0.813: v191.77,118.49 191.77,115.95 196.85,110.87 205.74,110.87 208.28,108.33 212.09,108.33 219.71,100.71 219.71,96.9 218.44,95.63 BLUE.4
  Bottom 0.813: U$1.17 173.99,121.03 175.26,119.76 180.34,119.76 181.61,121.03 SV3.5 189.23,121.03 v191.77,118.49
18  (via drill 0.61)
  Top 0.813: v193.04,119.76 ENC2.1
  Bottom 0.813: U$1.18 173.99,123.57 175.26,122.3 180.34,122.3 181.61,123.57 SV3.4 189.23,123.57 191.77,121.03 | 191.77,121.03 v193.04,119.76 | UENC3.3 217.17,123.57 209.55,123.57 207.01,121.03 191.77,121.03
19
  Top 0.813: UENC4.3 ENC2.2
  Bottom 0.813: U$1.19 173.99,126.11 175.26,124.84 180.34,124.84 181.61,126.11 SV3.3 199.39,126.11 UENC4.3
20  (via drill 0.61)
  Top 0.813: SV3.2 189.23,128.65 191.77,131.19 191.77,137.54 v196.85,142.62
  Bottom 0.813: U$1.20 173.99,128.65 175.26,127.38 180.34,127.38 181.61,128.65 SV3.2 | MAG.3 217.17,152.78 214.63,150.24 201.93,150.24 198.12,146.43 198.12,143.89 v196.85,142.62
21  (via drill 0.61)
  Top 0.813: MAG.4 217.17,155.32 212.09,160.4 195.58,160.4 195.58,151.51 194.31,150.24 194.31,148.97 199.39,143.89 199.39,140.08 198.12,138.81 196.85,138.81 195.58,137.54 v195.58,131.19
  Bottom 0.813: U$1.21 SV3.1 v195.58,131.19
22  (via drill 0.61)
  Top 0.813: v186.69,135 v184.15,137.54
  Bottom 0.813: U$1.22 170.18,137.54 172.72,135 180.34,135 182.88,137.54 v184.15,137.54 | v186.69,135 194.31,135 196.85,132.46 200.66,132.46 201.93,133.73 M1.2
23  (via drill 0.61)
  Top 0.813: U$1.23 170.18,142.62 171.45,143.89 171.45,152.78 170.18,154.05 SV8.2 | v175.26,161.67 175.26,162.94 214.63,162.94 218.44,159.13 226.06,159.13 226.06,145.16 v222.25,141.35 | M1.3 204.47,140.08 v210.82,140.08
  Bottom 0.813: v175.26,161.67 172.72,159.13 171.45,159.13 170.18,157.86 SV8.2 | v210.82,140.08 220.98,140.08 v222.25,141.35
24  (via drill 0.61)
  Top 0.813: U$1.24 167.64,137.54 166.37,136.27 166.37,131.19 v163.83,128.65 | v139.7,74.04 v139.7,114.68 | v168.91,66.42 185.42,49.91 193.04,49.91 M2.2
  Bottom 0.813: v163.83,128.65 154.94,119.76 144.78,119.76 v139.7,114.68 | v139.7,74.04 147.32,66.42 v168.91,66.42
25
  Top 0.813: U$1.25 167.64,142.62 168.91,143.89 168.91,152.78 167.64,154.05 SV8.3
  Bottom 0.813: SV8.3 167.64,155.32 168.91,154.05 182.88,154.05 184.15,152.78 189.23,152.78 190.5,154.05 M6.2
26  (via drill 0.61)
  Top 0.813: v152.4,124.84 152.4,79.12 149.86,76.58 v149.86,61.34 | v181.61,56.26 185.42,60.07 190.5,60.07 M2.3
  Bottom 0.813: U$1.26 165.1,137.54 157.48,129.92 157.48,124.84 v152.4,124.84 | v149.86,61.34 154.94,56.26 v181.61,56.26
27
  Top 0.813: U$1.27 165.1,142.62 166.37,143.89 166.37,152.78 165.1,154.05 SV8.4 165.1,160.4 172.72,160.4 173.99,159.13 175.26,159.13 176.53,160.4 186.69,160.4 187.96,159.13 M6.3
28  (via drill 0.61)
  Top 0.813: U$1.28 162.56,137.54 163.83,136.27 v163.83,131.19 | v166.37,128.65 167.64,127.38 v167.64,109.6 | v167.64,98.17 166.37,96.9 166.37,66.42 185.42,47.37 193.04,47.37 M3.2
  Bottom 0.813: v166.37,128.65 v163.83,131.19 | v167.64,98.17 v167.64,109.6
29  (via drill 0.61)
  Top 0.813: U$1.29 162.56,142.62 163.83,143.89 163.83,152.78 162.56,154.05 SV8.5 | v176.53,143.89 180.34,140.08 189.23,140.08 190.5,141.35 M7.2
  Bottom 0.813: v176.53,143.89 163.83,143.89 162.56,142.62 U$1.29
30  (via drill 0.61)
  Top 0.813: U$1.30 160.02,137.54 161.29,136.27 161.29,131.19 v162.56,129.92 | v160.02,127.38 160.02,67.69 187.96,39.75 190.5,39.75 M3.3
  Bottom 0.813: v160.02,127.38 v162.56,129.92
31  (via drill 0.61)
  Top 0.813: U$1.31 160.02,142.62 161.29,143.89 v161.29,148.97 161.29,152.78 160.02,154.05 SV8.6 | v182.88,148.97 185.42,148.97 187.96,146.43 M7.3
  Bottom 0.813: v161.29,148.97 v182.88,148.97
32  (via drill 0.61)
  Top 0.813: v157.48,114.68 U$1.32 | v137.16,107.06 137.16,61.34 v162.56,35.94
  Bottom 0.813: v157.48,114.68 149.86,107.06 v137.16,107.06 | v162.56,35.94 205.74,35.94 207.01,34.67 210.82,34.67 213.36,37.21 M4.2
33
  Top 0.813: U$1.33 157.48,142.62 158.75,143.89 158.75,152.78 157.48,154.05 SV8.7
  Bottom 0.813: SV8.7 157.48,157.86 163.83,164.21 203.64,164.21 arc-45 205.06,163.62 205.74,162.94 209.55,162.94 M8.2
34  (via drill 0.61)
  Top 0.813: U$1.34 154.94,137.54 149.86,132.46 v149.86,129.92 | v128.27,108.33 128.27,95.63 127,94.36 v127,76.58
  Bottom 0.813: v128.27,108.33 v149.86,129.92 | v127,76.58 160.02,43.56 184.15,43.56 187.96,39.75 204.47,39.75 207.01,42.29 209.55,42.29 210.82,41.02 M4.3
35  (via drill 0.61)
  Top 0.813: U$1.35 154.94,142.62 156.21,143.89 v156.21,151.51 156.21,152.78 154.94,154.05 SV8.8
  Bottom 0.813: v156.21,151.51 182.88,151.51 184.15,150.24 189.23,150.24 191.77,152.78 201.93,152.78 201.93,160.4 207.01,160.4 M8.3
36  (via drill 0.61)
  Top 0.813: U$1.36 152.4,137.54 147.32,132.46 147.32,124.84 149.86,122.3 v149.86,96.9 | v168.91,77.85 168.91,68.96 v176.53,61.34 | v193.04,61.34 194.31,60.07 v200.66,60.07
  Bottom 0.813: v168.91,77.85 v149.86,96.9 | v193.04,61.34 v176.53,61.34 | v200.66,60.07 204.47,56.26 208.28,56.26 213.36,51.18 M5.2
37  (via drill 0.61)
  Top 0.813: U$1.37 152.4,142.62 153.67,143.89 153.67,152.78 152.4,154.05 SV8.9 152.4,165.48 v207.01,165.48 | M9.2 209.55,151.51 v210.82,152.78
  Bottom 0.813: v210.82,152.78 213.36,152.78 215.9,155.32 215.9,164.21 214.63,165.48 v207.01,165.48
38  (via drill 0.61)
  Top 0.813: U$1.38 149.86,137.54 144.78,132.46 v144.78,117.22 | v135.89,108.33 134.62,107.06 134.62,48.64 v176.53,6.73 | v218.44,21.97 219.71,23.24 219.71,39.75 210.82,48.64 M5.3
  Bottom 0.813: v135.89,108.33 v144.78,117.22 | v176.53,6.73 199.39,6.73 214.63,21.97 v218.44,21.97
39  (via drill 0.61)
  Top 0.813: v196.85,150.24 203.2,150.24 207.01,146.43 M9.3
  Bottom 0.813: SV7.1 149.86,146.43 | 149.86,146.43 U$1.39 | v196.85,150.24 194.31,147.7 184.15,147.7 182.88,146.43 149.86,146.43
40  (via drill 0.61)
  Top 0.813: v152.4,127.38 v152.4,132.46 | v147.32,117.22 v147.32,122.3 | v177.8,107.06 177.8,62.61 v181.61,58.8 | v198.12,53.72 200.66,51.18 200.66,37.21 BMP4.3
  Bottom 0.813: U$1.40 147.32,137.54 v152.4,132.46 | v147.32,122.3 v152.4,127.38 | v147.32,117.22 165.1,117.22 171.45,110.87 173.99,110.87 v177.8,107.06 | v181.61,58.8 186.69,53.72 v198.12,53.72
41  (via drill 0.61)
  Top 0.813: D11.C 16.51,155.32 R25.2 17.78,156.59 25.4,164.21 109.22,164.21 v109.22,162.94
  Bottom 0.813: SV7.2 147.32,152.78 | 147.32,152.78 U$1.41 | v109.22,162.94 118.11,162.94 128.27,152.78 147.32,152.78
42  (via drill 0.61)
  Top 0.813: v123.19,115.95 120.65,113.41 v120.65,67.69 | v152.4,35.94 175.26,13.08 175.26,10.54 179.07,6.73 212.09,6.73 BMP2.3
  Bottom 0.813: U$1.42 144.78,137.54 128.27,121.03 128.27,115.95 v123.19,115.95 | v152.4,35.94 v120.65,67.69
43  (via drill 0.61)
  Top 0.813: D12.C 26.67,155.32 R26.2 | U$1.43 144.78,142.62 146.05,143.89 146.05,152.78 144.78,154.05 SV7.3 | v101.6,133.73 111.76,143.89 123.19,143.89 v123.19,160.4
  Bottom 0.813: D12.C 25.4,151.51 39.37,151.51 40.64,150.24 40.64,141.35 44.45,141.35 46.99,143.89 50.8,143.89 52.07,142.62 52.07,141.35 54.61,138.81 54.61,133.73 64.77,133.73 66.04,132.46 83.82,132.46 85.09,133.73 v101.6,133.73 | v123.19,160.4 142.24,160.4 144.78,157.86 SV7.3
44  (via drill 0.61)
  Top 0.813: v130.81,132.46 124.46,138.81 118.11,138.81 v118.11,74.04 | v184.15,41.02 195.58,29.59 BMP1.3
  Bottom 0.813: U$1.44 142.24,137.54 137.16,132.46 v130.81,132.46 | v118.11,74.04 151.13,41.02 v184.15,41.02
45  (via drill 0.61)
  Top 0.813: D13.C 36.83,155.32 R27.2 | U$1.45 142.24,142.62 143.51,143.89 143.51,152.78 142.24,154.05 SV7.4 142.24,157.86 v137.16,162.94
  Bottom 0.813: R27.2 44.45,164.21 107.95,164.21 109.22,165.48 118.11,165.48 120.65,162.94 v137.16,162.94
46  (via drill 0.61)
  Top 0.813: v137.16,135 139.7,132.46 139.7,117.22 142.24,114.68 142.24,58.8 v162.56,38.48 | v184.15,38.48 191.77,30.86 191.77,18.16 BMP3.3
  Bottom 0.813: U$1.46 139.7,137.54 v137.16,135 | v184.15,38.48 v162.56,38.48
47
  Top 0.813: U$1.47 139.7,142.62 140.97,143.89 140.97,152.78 139.7,154.05 SV7.5 139.7,157.86 134.62,162.94 111.76,162.94 PS2.6
48
  Top 0.813: U$1.48 137.16,137.54 142.24,132.46 142.24,117.22 144.78,114.68 144.78,61.34 182.88,23.24 182.88,19.43 186.69,15.62 D10.C 186.69,11.81 R24.2
49  (via drill 0.61)
  Top 0.813: SV7.6 U$1.49 | PS2.5 120.65,157.86 v120.65,152.78
  Bottom 0.813: v120.65,152.78 128.27,145.16 134.62,145.16 137.16,142.62 U$1.49
50  (via drill 0.61)
  Top 0.813: v134.62,109.6 U$1.50 | v157.48,86.74 157.48,58.8 182.88,33.4 182.88,27.05 186.69,23.24 D9.C 186.69,19.43 R23.2
  Bottom 0.813: v134.62,109.6 133.35,108.33 133.35,96.9 147.32,96.9 v157.48,86.74
51  (via drill 0.61)
  Top 0.813: SV7.7 134.62,150.24 | 134.62,150.24 U$1.51 | 134.62,150.24 v133.35,150.24
  Bottom 0.813: PS2.4 123.19,155.32 128.27,150.24 v133.35,150.24
52  (via drill 0.61)
  Top 0.813: v116.84,140.08 115.57,138.81 v115.57,70.23 | R22.2 186.69,27.05 D8.C
  Bottom 0.813: U$1.52 132.08,137.54 130.81,136.27 128.27,136.27 124.46,140.08 v116.84,140.08 | v115.57,70.23 152.4,33.4 184.15,33.4 D8.C
53  (via drill 0.61)
  Top 0.813: U$1.53 132.08,142.62 130.81,143.89 130.81,145.16 | 130.81,145.16 130.81,152.78 132.08,154.05 SV7.8 | v125.73,145.16 130.81,145.16
  Bottom 0.813: v125.73,145.16 118.11,152.78 PS2.3 107.95,152.78 101.6,159.13 45.72,159.13 43.18,156.59 R21.2
A0  (via drill 0.61)
  Top 0.813: v157.48,51.18 147.32,61.34 v147.32,68.96 | v132.08,86.74 v132.08,79.12
  Bottom 0.813: SV4.8 123.19,95.63 | 123.19,95.63 U$1.A0 | M10.3 210.82,56.26 214.63,56.26 219.71,51.18 219.71,46.1 203.2,46.1 198.12,51.18 v157.48,51.18 | v147.32,68.96 137.16,79.12 v132.08,79.12 | 123.19,95.63 v132.08,86.74
A1  (via drill 0.61)
  Top 0.813: v129.54,94.36 v129.54,77.85
  Bottom 0.813: SV4.7 U$1.A1 125.73,98.17 v129.54,94.36 | M10.2 213.36,63.88 210.82,66.42 193.04,66.42 190.5,63.88 143.51,63.88 v129.54,77.85
A2
  Bottom 0.813: U$1.A2 123.19,100.71 121.92,101.98 113.03,101.98 111.76,100.71 SV4.6 SHARP1.3
A3
  Bottom 0.813: U$1.A3 123.19,103.25 121.92,104.52 113.03,104.52 111.76,103.25 SV4.5 88.9,103.25 SHARP2.3
A4
  Bottom 0.813: U$1.A4 123.19,105.79 121.92,107.06 113.03,107.06 111.76,105.79 SV4.4 86.36,105.79 83.82,103.25 73.66,103.25 SHARP3.3
A5
  Bottom 0.813: U$1.A5 123.19,108.33 121.92,109.6 113.03,109.6 111.76,108.33 SV4.3 91.44,108.33 SHARP4.3
A6  (via drill 0.61)
  Top 0.813: v105.41,98.17 105.41,108.33 107.95,110.87 SV4.2
  Bottom 0.813: U$1.A6 123.19,110.87 121.92,112.14 113.03,112.14 111.76,110.87 SV4.2 | USONIC.3 54.61,95.63 55.88,94.36 82.55,94.36 85.09,91.82 87.63,91.82 88.9,90.55 97.79,90.55 v105.41,98.17
A7  (via drill 0.61)
  Top 0.813: SV4.1 105.41,113.41 93.98,101.98 93.98,93.09 91.44,93.09 90.17,91.82 86.36,91.82 83.82,89.28 81.28,89.28 81.28,79.12 v73.66,79.12
  Bottom 0.813: U$1.A7 123.19,113.41 121.92,114.68 110.49,114.68 SV4.1 | USONIC.2 52.07,90.55 54.61,90.55 66.04,79.12 v73.66,79.12
A8
  Bottom 0.813: U$1.A8 SV5.8 104.14,113.41 54.61,113.41 USONIC2.3
A9
  Bottom 0.813: U$1.A9 SV5.7 106.68,121.03 101.6,115.95 52.07,115.95 USONIC2.2
A10
  Top 0.813: R19.2 R20.1 49.53,129.92 D7.C
  Bottom 0.813: U$1.A10 123.19,123.57 121.92,124.84 113.03,124.84 111.76,123.57 SV5.6 99.06,123.57 93.98,128.65 85.09,128.65 83.82,129.92 66.04,129.92 64.77,128.65 53.34,128.65 D7.C
A11
  Top 0.813: R18.1 R17.2
  Bottom 0.813: D6.C 99.06,126.11 R18.1 SV5.5 111.76,126.11 113.03,127.38 121.92,127.38 123.19,126.11 U$1.A11
A12
  Top 0.813: R9.2 R10.1 49.53,146.43 D2.C
  Bottom 0.813: U$1.A12 123.19,128.65 121.92,129.92 113.03,129.92 111.76,128.65 SV5.4 104.14,128.65 104.14,136.27 101.6,138.81 99.06,138.81 93.98,143.89 87.63,143.89 85.09,146.43 66.04,146.43 63.5,148.97 54.61,148.97 52.07,146.43 D2.C
A13
  Top 0.813: R12.1 R11.2
  Bottom 0.813: D3.C 99.06,141.35 R12.1 101.6,141.35 106.68,136.27 106.68,131.19 SV5.3 111.76,131.19 113.03,132.46 121.92,132.46 123.19,131.19 U$1.A13
A14
  Top 0.813: SV5.2 107.95,133.73 104.14,129.92 104.14,117.22 100.33,117.22 95.25,122.3 95.25,159.13 53.34,159.13 D4.C 49.53,160.4 R14.1 R13.2
  Bottom 0.813: U$1.A14 123.19,133.73 121.92,135 113.03,135 111.76,133.73 SV5.2
A15
  Top 0.813: R16.1 99.06,157.86 D5.C
  Bottom 0.813: U$1.A15 123.19,136.27 121.92,137.54 114.3,137.54 | 114.3,137.54 110.49,137.54 SV5.1 | 114.3,137.54 102.87,148.97 | 102.87,148.97 R15.2 | R16.1 105.41,151.51 105.41,148.97 102.87,148.97
AREF
  Bottom 0.813: U$1.AREF 173.99,68.96 176.53,66.42 185.42,66.42 SV1.8
B3V3  (via drill 0.6)
  Top 0.813: S2.P 203.2,108.33 205.74,108.33 v210.82,103.25
  Bottom 0.813: v210.82,103.25 210.82,94.36 214.63,90.55 BLUE.2
DIN
  Top 0.813: LED5.A R5.1
GND  (via drill 0.6)
  other vias: 193.04,160.4
  pour Bottom: 5.08,168.02 228.6,168.02 228.6,4.19 5.08,4.19
  pour Top: 5.08,168.02 228.6,168.02 228.6,4.19 5.08,4.19
JOK1
  Top 0.813: R6.3 12.7,84.2 R7.1
  Bottom 0.813: R7.1 12.7,88.01 21.59,96.9 LM317.GND
KEY
  Top 0.813: S2.S 200.66,100.71 BLUE.6
N$4
  Top 0.813: R8.1 LED6.K
N$13
  Top 0.813: LED4.A 72.39,51.18 72.39,71.5 76.2,75.31 R4.2
N$16
  Top 0.813: LED3.A 66.04,23.24 66.04,49.91 68.58,52.45 68.58,57.53 66.04,60.07 R3.2
N$17
  Top 0.813: LED2.A 80.01,38.48 80.01,63.88 76.2,67.69 R2.2
N$20
  Top 0.813: LED1.A 76.2,44.83 R1.2
PN1
  Top 1.778: J3.2 133.35,10.54 IC1.16 IC1.15
PN2
  Top 1.778: IC1.14 IC1.13 128.27,20.7 J4.2
PN3
  Top 1.778: IC1.12 IC1.11 134.62,25.78 J5.2
PN4
  Top 1.778: IC2.15 IC2.16 34.29,133.73 41.91,126.11 J6.2
PN5
  Top 1.778: IC2.13 IC2.14 26.67,129.92 30.48,126.11 30.48,124.84 J7.2
PN6
  Top 1.778: IC2.12 IC2.11 19.05,131.19 17.78,129.92 17.78,124.84 J8.2
RESET
  Top 0.813: S1.1A S1.1B
  Bottom 0.813: U$1.RESET SV6.6 82.55,77.85 82.55,82.93 S1.1A
S1
  Top 0.813: R19.1 IFM1.3
S2
  Bottom 0.813: IFM2.3 R17.1
S3
  Top 0.813: IFM3.3 R9.1
S4
  Bottom 0.813: IFM4.3 R11.1
S5
  Top 0.813: R13.1 IFM5.3
S6
  Bottom 1.27: IFM6.3 R15.1
U1
  Top 0.813: IC1.6 IC1.5
  Bottom 0.813: R22.1 175.26,23.24 IC1.5
U2
  Top 0.813: IC1.4 IC1.3
  Bottom 0.813: R23.1 175.26,20.7 IC1.4
U3
  Top 0.813: IC1.2 IC1.1
  Bottom 0.813: R24.1 175.26,13.08 IC1.1
U4
  Top 0.813: IC2.5 IC2.6 19.05,143.89 R25.1
U5
  Top 0.813: IC2.3 IC2.4 24.13,143.89 R26.1
U6
  Top 0.813: IC2.2 IC2.1 R27.1
VAROUT
  Top 1.778: VARREL.1 VARREL.2 VARREL.3 | LM317.OUT 40.64,99.44 54.61,85.47 C5.1
  Bottom 0.813: R6.1 31.75,90.55 45.72,90.55 52.07,84.2 C5.1
  Bottom 1.778: VARREL.1 99.06,62.61 99.06,72.77 66.04,72.77 65.72,73.09 | C5.1 65.72,73.09 | R4.1 66.04,73.41 65.72,73.09
VCC  (via drill 0.61)
  Top 0.813: SV8.1 175.26,154.05 175.26,145.16 172.72,142.62 U$1.GND@5 U$1.GND@4 172.72,137.54 168.91,133.73 v168.91,128.65 | v162.56,114.68 v162.56,122.3 | v147.32,94.36 v147.32,99.44
  Bottom 0.813: LED6.A 90.17,81.66 91.44,82.93 SV6.4 111.76,82.93 113.03,84.2 121.92,84.2 123.19,82.93 U$1.5V 125.73,82.93 127,84.2 137.16,84.2 v147.32,94.36 | v162.56,122.3 v168.91,128.65 | v147.32,99.44 v162.56,114.68
VIN
  Top 1.778: 9REL.3 95.25,58.17 100.97,63.88 100.97,86.11 105.41,90.55 SV6.1 109.86,90.55
  Bottom 0.813: 80.33,57.21 R3.1
  Bottom 1.778: 7809.OUT 40.64,39.75 C4.1 58.42,57.53 80.01,57.53 80.33,57.21 80.96,57.21 83.19,54.99 9REL.1 9REL.2 9REL.3 | SV6.1 U$1.VIN

### Text on the board
tTest: (A10 ->A15,+,-) | GND / 53 / 51 / 49 / 47 / 45 / 43 / 41 / 39 / 37 / 35 / 33 / 31 / 29 / 27 / 25 / 23 / VCC | PS2 | (41,43,45) | M8(-,35,33,7) | M6(-,27,25,5) | IFM5 | IFM6 | 31 | MAG | GND / / 50,51 / 48,49 / 46,47 / 44,45 / 42,43 | 40,41 / 38,39 / 36,37 / / 32,33 / / 28,29 / 26,27 / 24,25 / 22,23 / VCC | M7(-,31,29,6) | M9(-,39,37,8) | (-.+,20,21) | (-,+,53,51,49,47) | 34,35 | 30 | 52,53 | 10K | M1(4,22,23,-) | IFM3 | IFM4 | ULN2003_1 | U_ENC4 | (18,+,-) | U_ENC3 | IFM1 | IFM2 | (19,+,-) | A15 / A14 / A13 / A12 / A11 / A10 / A9 / A8 | (18,19,+,-) | PN1 | PN2 | PN3 | ULT_SON2 | SHARP4 | 21 / 20 / 19 / 18 / 17 / 16 / 15 / 14 | UART3 | BI_ENC2 | (14,15,-) | (+,-,A5) | (-,A9,A8,+) | SHARP3 | (A4,-+) | SHARP2 | SHARP1 | ULT_SON1 | (-,+,3) | A7 / A6 / A5 / A4 / A3 / A2 / A1 / A0 | U_ENC2 | (-,A7,A6,+) | (+,-,A3) | (+,-,A2) | LM317 | BLUE | 0 / 1 / 2 / 3 / 4 / 5 / 6 / 7 | RESET | (-,+,2) | (KEY,16,17,+,3V3,-) | U_ENC1 | VIN / GND / GND / 5V / 3.3V / RESET | ARD_LED | ARDUINO | 6REL | GNDREL | 8 / 9 / 10 / 11 / 12 / 13 | BI_ENC1 | (1,0,-) | UART0 | GND / AREF | (-,+,3,2) | LM7806 | 9REL | VARREL | M10(-,A0,A1,9) | M2(13,26,24,-) | M5(10,38,36,-) | 5REL | VAR | 12REL | M3(12,30,28,-) | 5 | ULN2003_2 | M4(11,34,32,-) | LM7809 | PN4 | BUMP1 | BUMP3 | 6 | (48,50,52) | (44,+,-) | (40,+,-) | 9 | PN5 | BUMP2 | BUMP4 | TEAM ROBOCON IITR | LM7805 | 2015 | (46,+,-) | (42,+,-) | 12 | (12V,GND) | (12V,GND) | (12V,GND) | PN6